# Altium schematic sheet Res 120R.schdoc
size 127 x 99 mm
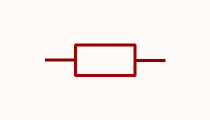
[diagram p0: Res 120R.schdoc]

## Parts
R?  120Ω  [R0603]  (value not drawn)

## Nets

Not connected (* = marked no-connect by the designer): R? 1 2

## Library data of the parts
R? = ERJPA3F1200V: Manufacturer: PANASONIC(松下); Add into BOM: yes; Tolerance: ±1%; Power(Watts): 250mW; Temperature Coefficient: ±100ppm/℃; Symbol: ERJPA3F1200V; Device: ERJPA3F1200V; LCSC Part Name: 120Ω ±1% 250mW 厚膜电阻; Supplier Part: C543338; Manufacturer Part: ERJPA3F1200V; Supplier Footprint: 0603; JLCPCB Part Class: Extended Part; Datasheet: https://atta.szlcsc.com/upload/public/pdf/source/20200515/C543414_D3FB4A44C151AC19BA141503575FC797.pdf; Supplier: LCSC; Convert to PCB: yes; Type: Thick Film Resistors; Value: 120Ω; Overload Voltage (Max): -; Operating Temperature Range: -55℃~+155℃